# EAGLE design CurrentRestrictionBoard_V1_0 (EAGLE 6.1)
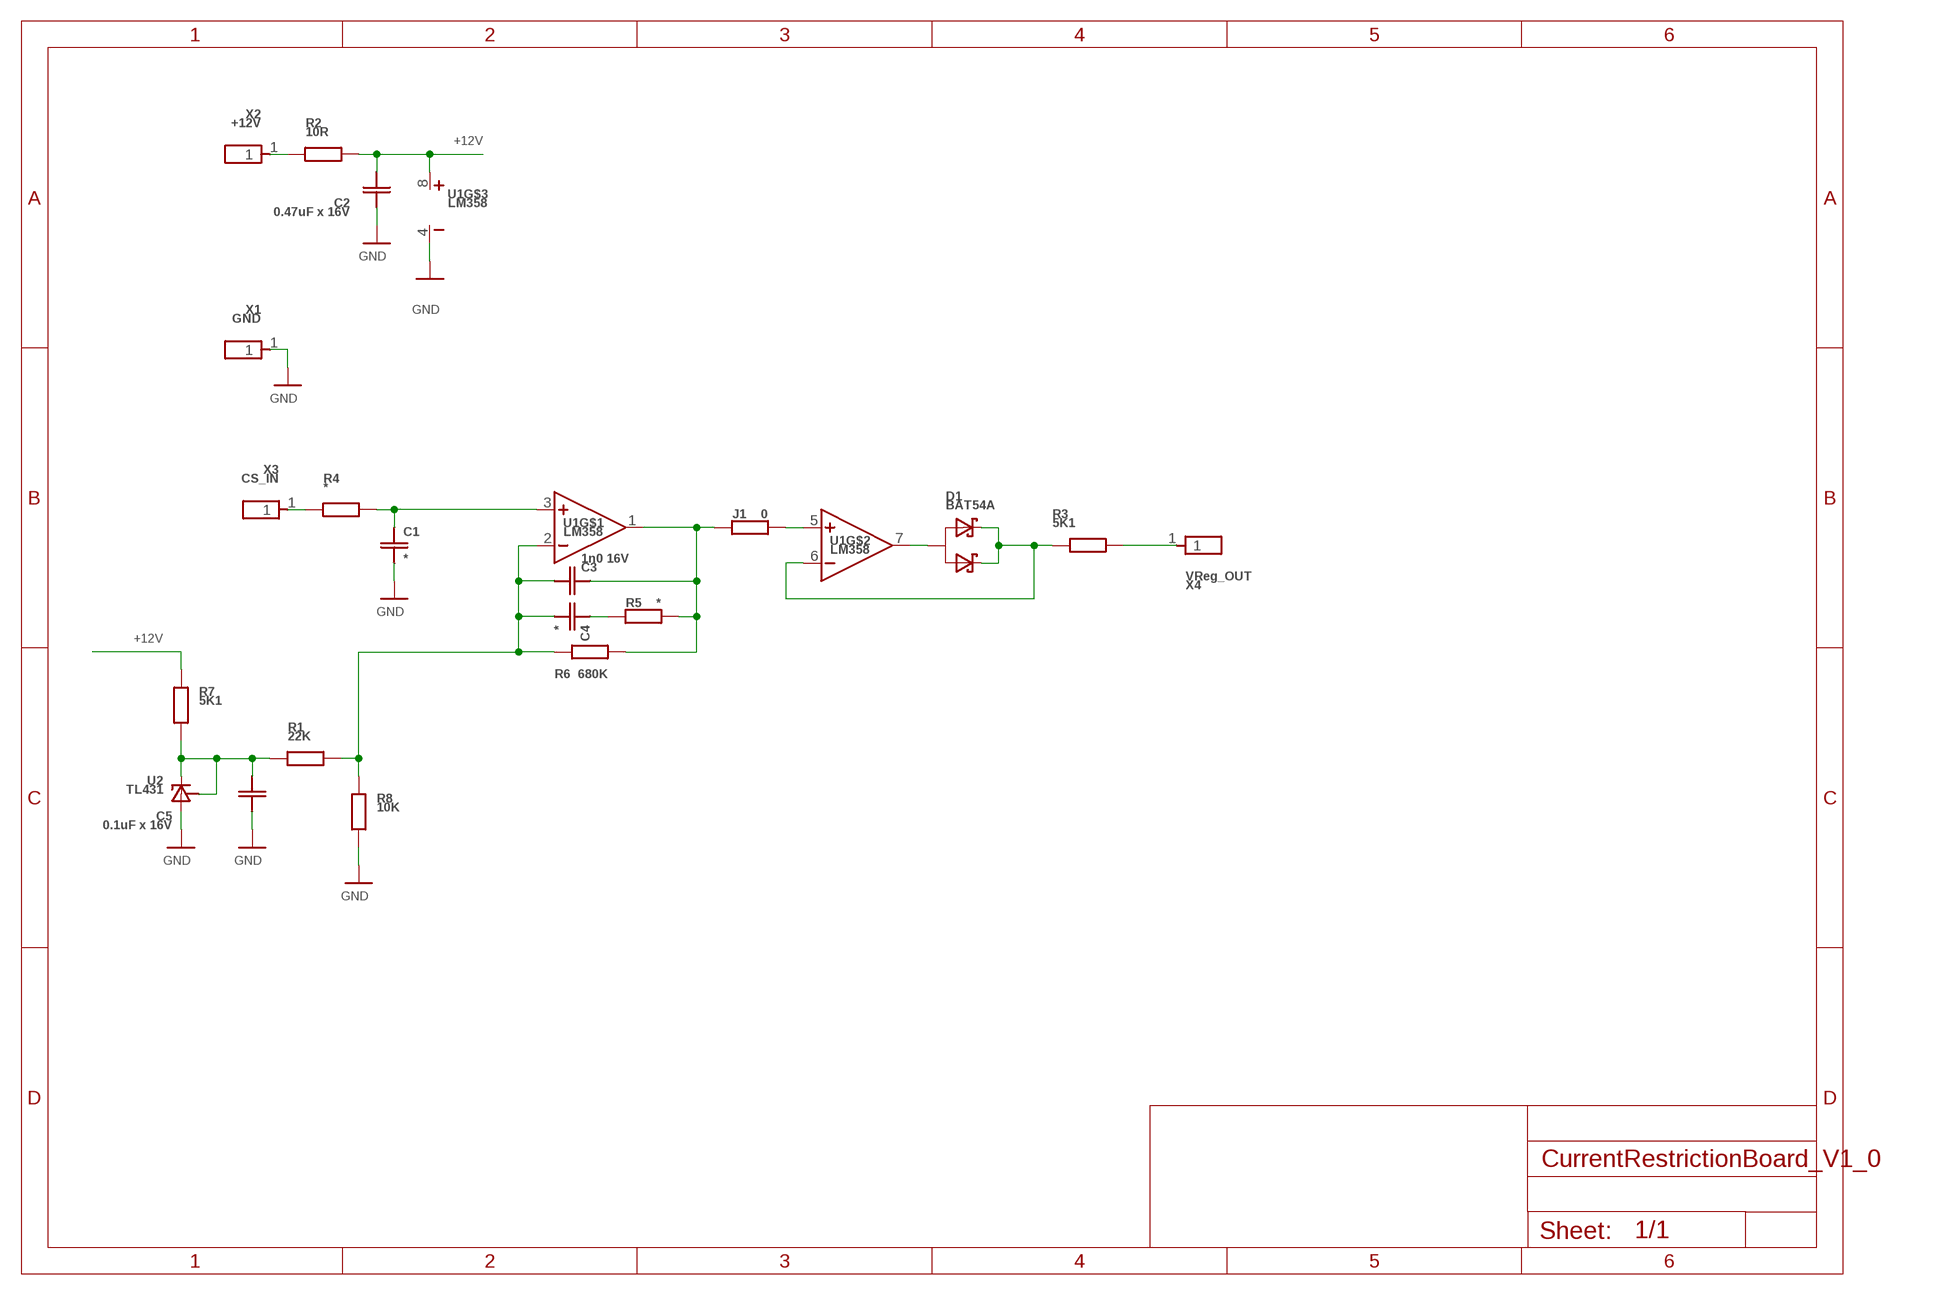
[diagram p0: schematic, sheet 1]

## Parts
C1  *  CSMD_0603  [RSMD_0603]
C2  0.47uF x 16V  CSMD_0805  [RSMD_0805]
C3  1n0 16V  CSMD_0603  [RSMD_0603]
C4  *  CSMD_0603  [RSMD_0603]
C5  0.1uF x 16V  CSMD_0603  [RSMD_0603]
D1  BAT54A  BAT54ASOT23_SMALL_PADS  [SOT23_SMALL_PADS]
J1  0  RSMD_0805  [RSMD_0805]
R1  22K  RSMD_0603  [RSMD_0603]
R2  10R  RSMD_0805  [RSMD_0805]
R3  5K1  RSMD_0603  [RSMD_0603]
R4  *  RSMD_0603  [RSMD_0603]
R5  *  RSMD_0603  [RSMD_0603]
R6  680K  RSMD_0603  [RSMD_0603]
R7  5K1  RSMD_0805  [RSMD_0805]
R8  10K  RSMD_0603  [RSMD_0603]
U1  LM358  LM358SOIC8  [SOIC8]
U2  TL431  TL431SOT23  [SOT23]
X1  GND  PIN1X1PAD_2.5X2.5  [PIN1X1_2.5X2.5MM]
X2  +12V  PIN1X1PAD_2.5X2.5  [PIN1X1_2.5X2.5MM]
X3  CS_IN  PIN1X1PAD_2.5X2.5  [PIN1X1_2.5X2.5MM]
X4  VReg_OUT  PIN1X1PAD_2.5X2.5  [PIN1X1_2.5X2.5MM]

## Nets
+12V: C2.PAD_1(PIN1) R2.PAD_0(PIN0) R7.PAD_1(PIN1) U1.8(VCC)
GND: C1.PAD_0(PIN0) C2.PAD_0(PIN0) C5.PAD_0(PIN0) R8.PAD_0(PIN0) U1.4(GND) U2.3(ANODE) X1.1
N$1: R2.PAD_1(PIN1) X2.1
N$2: R4.PAD_1(PIN1) X3.1
N$3: C1.PAD_1(PIN1) R4.PAD_0(PIN0) U1.3(IN+)
N$4: C3.PAD_0(PIN0) C4.PAD_0(PIN0) R1.PAD_0(PIN0) R6.PAD_1(PIN1) R8.PAD_1(PIN1) U1.2(IN-)
N$5: C3.PAD_1(PIN1) J1.PAD_1(PIN1) R5.PAD_0(PIN0) R6.PAD_0(PIN0) U1.1(OUT)
N$6: C4.PAD_1(PIN1) R5.PAD_1(PIN1)
N$7: D1.1(CATHODE1) D1.2(CATHODE2) R3.PAD_1(PIN1) U1.6(IN-)
N$8: D1.3(ANODE) U1.7(OUT)
N$9: R3.PAD_0(PIN0) X4.1
N$10: C5.PAD_1(PIN1) R1.PAD_1(PIN1) R7.PAD_0(PIN0) U2.1(CATHODE) U2.2(REFERENCE)
N$11: J1.PAD_0(PIN0) U1.5(IN+)

## Library data of the parts
C1-C5 = __MyCommonLib1:C
D1 = __MyCommonLib1:BAT54A
J1 R1-R8 = __MyCommonLib1:R
U1 = __MyCommonLib1:LM358
U2 = __MyCommonLib1:TL431
X1-X4 = __MyCommonLib1:PIN1X1

## Board
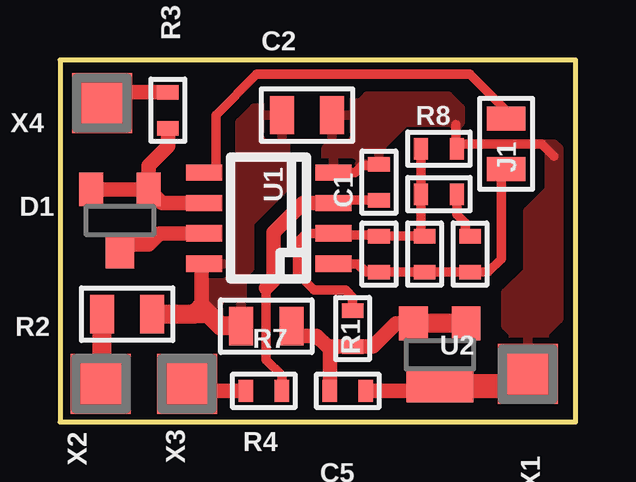
[diagram p1: board, top side]

Size 21.5 x 15.1 mm. Coordinates in mm from the lower left corner, seen from the top.
Outline: 0,0 21.5,0 21.5,15.1 0,15.1 0,0
Copper layers (1*16): Top 0.035mm / dielectric 1.5mm / Bottom 0.035mm
Design rules: minimum track width 0.4mm, minimum drill 0.6mm, track to track 0.35mm, track to pad 0.35mm, pad to pad 0.35mm, via to via 0.35mm, smd to smd 0mil, copper to edge 0.2mm, drill to drill 8mil, minimum pad ring 10mil, minimum via ring 8mil, stop-mask expansion 4mil, vias tented up to drill 0mil, thermal gap 10mil

### Footprints (pad centres in the part's own frame; a part is rotated, then mirrored left to right if it is on the bottom)
RSMD_0603 = smd 0.6 x 0.9: PAD_0 -0.75,0; PAD_1 0.75,0
RSMD_0805 = smd 1 x 1.6: PAD_0 -1.05,0; PAD_1 1.05,0
SOT23_SMALL_PADS = smd 1 x 1.4: 1 1.2,1.3; 2 -1.2,1.3 | smd 1.2 x 1.4: 3 0,-1.3
SOIC8 = smd 1.5 x 0.68: 1 -2.699,1.905; 2 -2.699,0.635; 3 -2.699,-0.635; 4 -2.699,-1.905; 5 2.699,-1.905; 6 2.699,-0.635; 7 2.699,0.635; 8 2.699,1.905
SOT23 = smd 1.2 x 1.4: 1 1.1,1.3; 2 -1.1,1.3 | smd 2.8 x 1.4: 3 0,-1.3
PIN1X1_2.5X2.5MM = smd 2.5 x 2.5: 1 0,0

### Placement (x,y rotation side)
C1  13.3,10 270 top
C2  10.3,12.8 180 top
C3  13.3,7 270 top
C4  15.8,9.5 0 top
C5  12,1.3 180 top
D1  2.5,8.4 0 top
J1  18.6,11.6 270 top
R1  12.2,3.9 270 top
R2  2.8,4.5 180 top
R3  4.5,13 270 top
R4  8.5,1.3 180 top
R5  17.1,7 90 top
R6  15.2,7 90 top
R7  8.6,4 180 top
R8  15.8,11.4 180 top
U1  8.7,8.5 180 top
U2  15.84,2.81 0 top
X1  19.5,2 0 top
X2  1.7,1.6 0 top
X3  5.3,1.6 0 top
X4  1.75,13.3 0 top

### Tracks (layer width: path | path; a pad name or v marks a point on that pad's centre or on a via)
+12V
  Top 0.6: U1.8 5.9,6.49 5.9,4.8
  Top 0.8: R2.PAD_0 5.6,4.5 | 5.6,4.5 5.9,4.8 6.2,4.5 | 6.2,4.5 5.6,4.5 | R7.PAD_1 6.7,4 6.2,4.5
  pour Top: 5.8,4.8 6.7,3.9 7.6,3.9 7.6,6.1 7.9,6.4 7.9,8.3 9.4,9.8 9.4,13.1 8.1,13.1 7.5,12.5 7.5,7 7.1,6.6 5.8,6.6
GND
  Top 0.4: U1.4 12.3,10.4 12.6,10.7 13.25,10.7 C1.PAD_0 | 20.6,11.1 20.1,11.6 16.75,11.6 R8.PAD_0 16.5,11.45 16.5,12.4
  Top 0.6: C5.PAD_0 15.63,1.3 U2.3
  Top 1: U2.3 19.01,1.51 X1.1
  pour Top: 11.1,10.3 12.2,10.3 12.6,10.7 13.4,10.7 13.4,11.5 14.4,12.5 16.3,12.5 16.5,12.3 16.7,12.5 16.7,13.1 16.2,13.6 12.8,13.6 12.5,13.3 11.3,13.3 11.3,11.6 11.1,11.4
  pour Top: 18.6,5.4 18.6,4 18.9,3.7 18.9,1.5 20.2,1.5 20.2,3.7 20.8,4.3 20.8,11.4 20.6,11.6 20.1,11.6 20.4,11.3 20.4,9.7 19.5,8.8 19.5,6.3
N$1
  Top 0.8: X2.1 1.75,1.65 R2.PAD_1
N$2
  Top 0.6: X3.1 5.6,1.3 R4.PAD_1
N$3
  Top 0.4: U1.3 11.51,9.25 C1.PAD_1 | R4.PAD_0 9.25,1.95 8.6,2.6 8.6,5.6
  Top 0.6: U1.3 10.13,9.13 8.9,7.9 8.9,5.9 8.6,5.6
N$4
  Top 0.4: 11.36,7.9 U1.2 | R8.PAD_1 C4.PAD_0 15.05,7.75 R6.PAD_1 C3.PAD_0 13.25,7.8 11.46,7.8 U1.2 | U1.2 10.27,7.87 9.9,7.5 9.9,6.2 10.6,5.5 11.9,5.5 12.2,5.2 R1.PAD_0
N$5
  Top 0.4: U1.1 12.4,6.59 12.75,6.25 C3.PAD_1 R6.PAD_0 R5.PAD_0 17.85,6.25 18.4,6.8 18.4,10.35 J1.PAD_1
N$6
  Top 0.4: C4.PAD_1 16.55,8.65 16.9,8.3 16.9,7.95 R5.PAD_1
N$7
  Top 0.6: D1.2 D1.1 | U1.6 4.26,9.13 D1.1 | D1.1 3.7,10.7 4.5,11.5 R3.PAD_1
N$8
  Top 0.6: U1.7 4.17,7.87 3.7,7.4 2.8,7.4 D1.3
N$9
  Top 0.6: R3.PAD_0 2.2,13.75 X4.1
N$10
  Top 0.6: R7.PAD_0 10.05,3.6 10.7,3.6 11.15,3.15 11.5,3.15 | 11.5,3.15 R1.PAD_1 13.05,3.15 14.01,4.11 U2.2 | C5.PAD_1 11.25,2.9 11.5,3.15
  Top 0.8: U2.1 U2.2
N$11
  Top 0.4: J1.PAD_0 18.6,13 17.1,14.5 8.2,14.5 6.5,12.8 6.5,10.41 U1.5